# Altium schematic sheet 智联屏.SchDoc
size A2
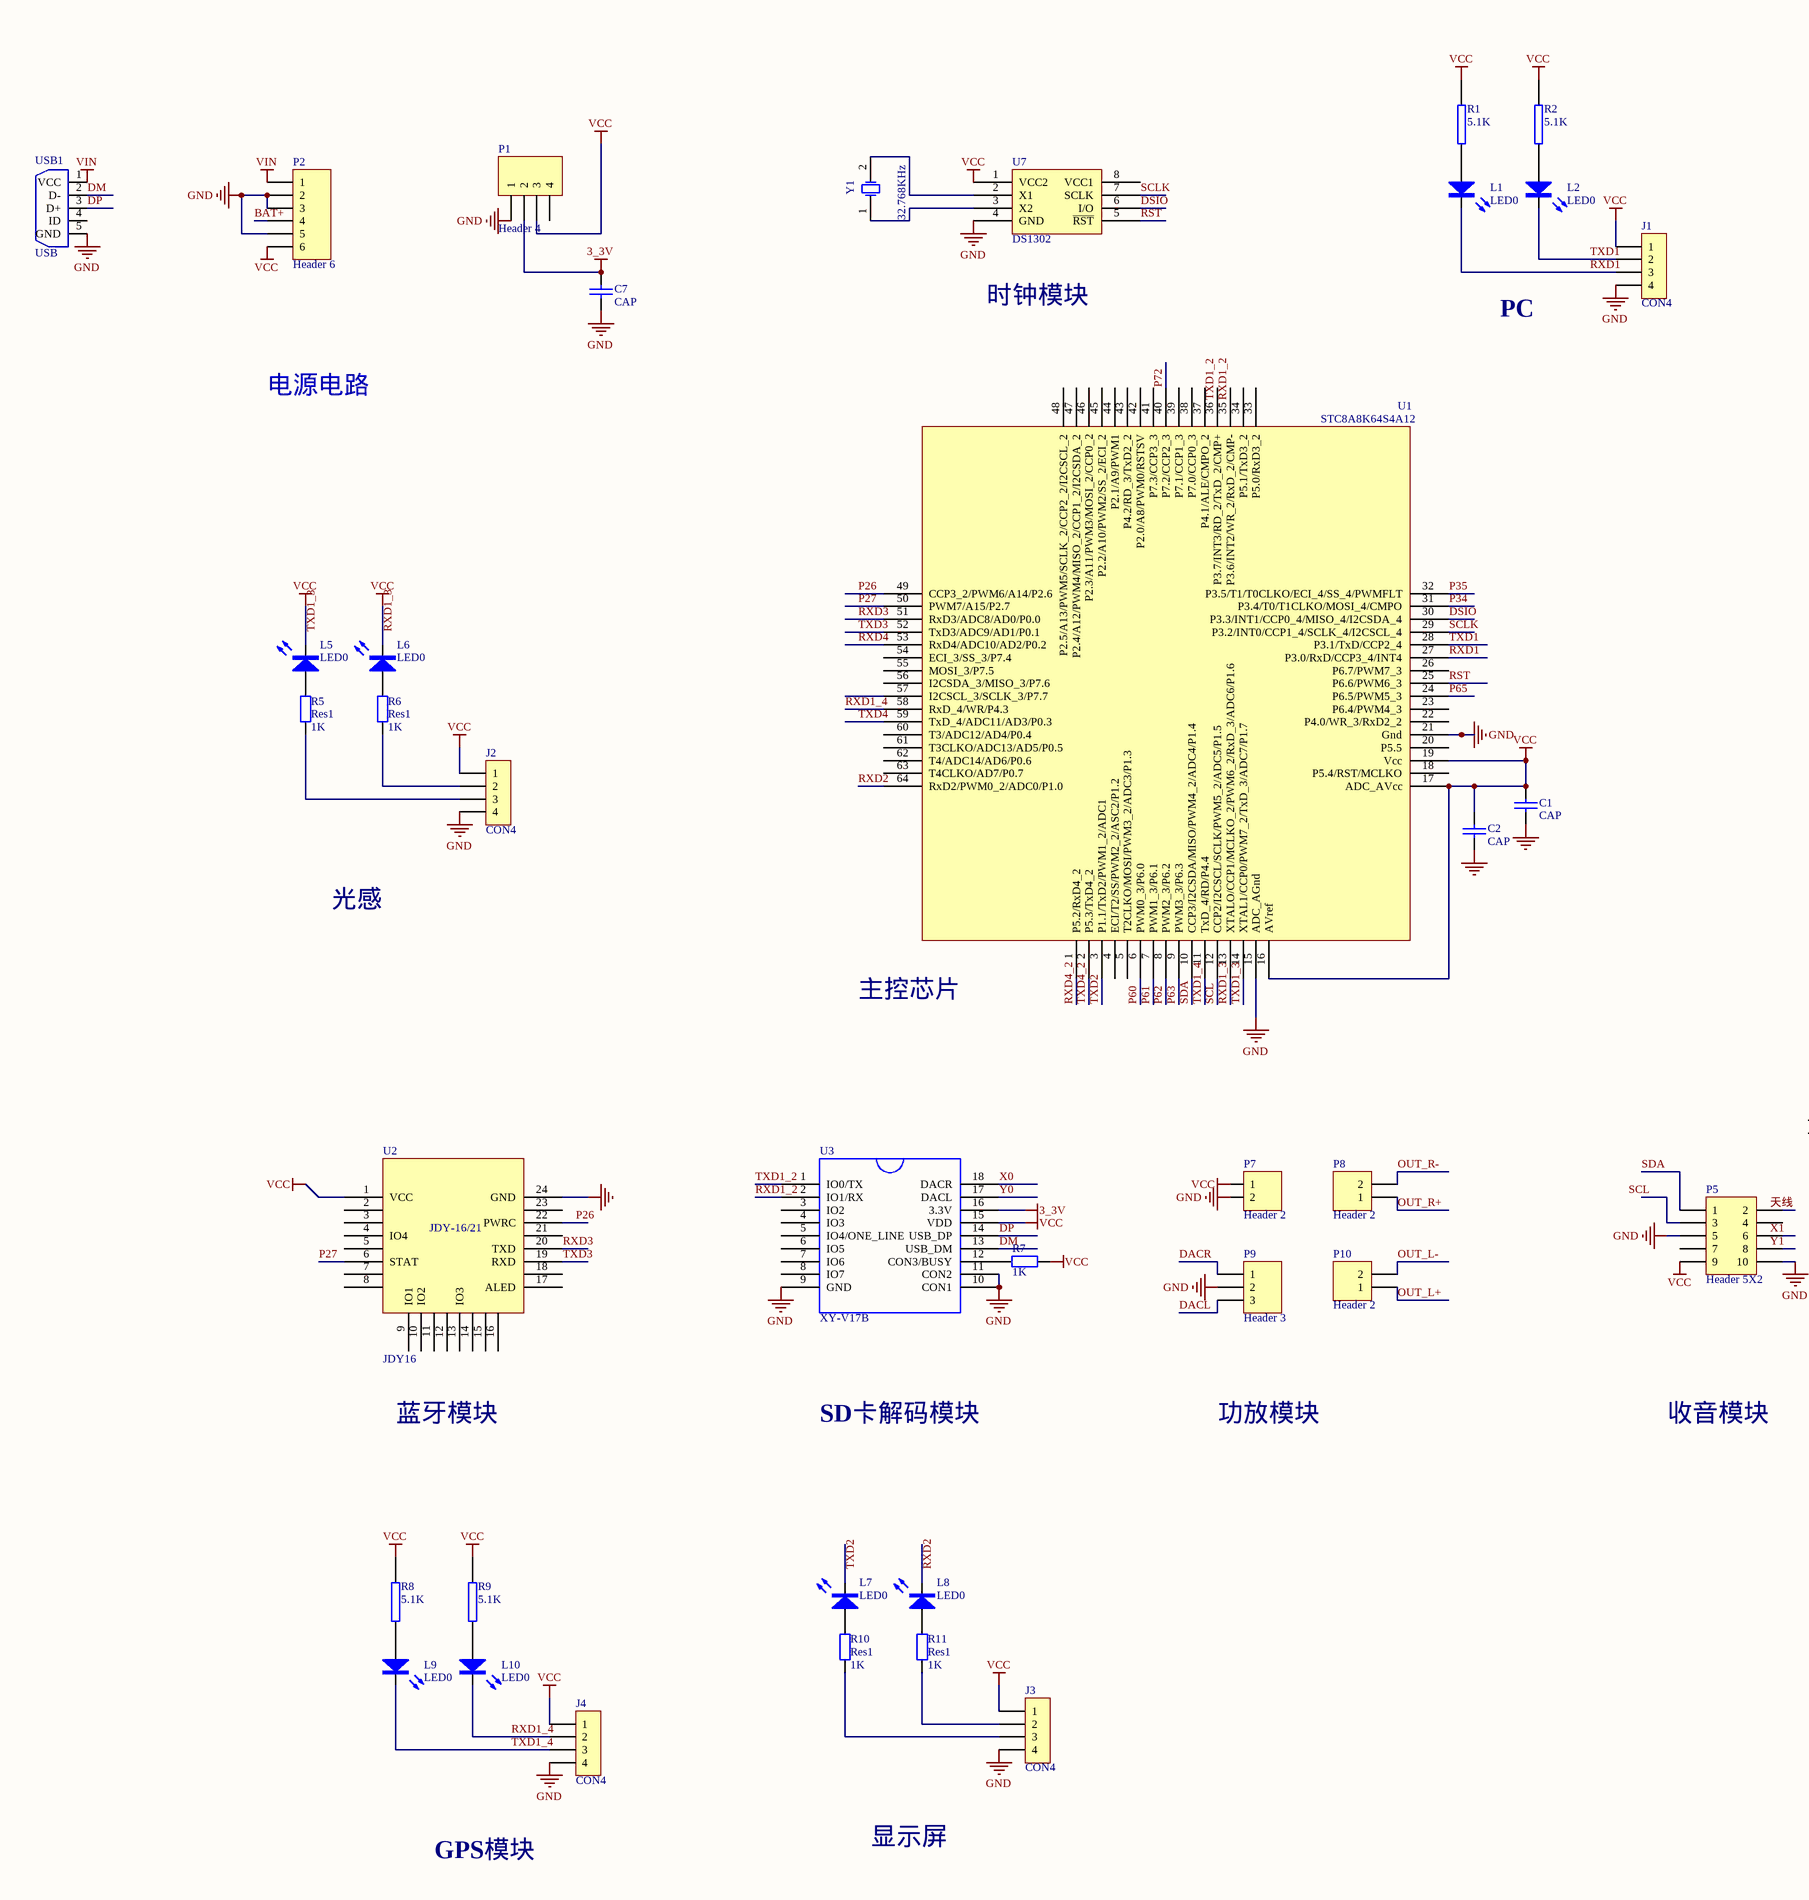
[diagram p0: 智联屏.SchDoc, left]
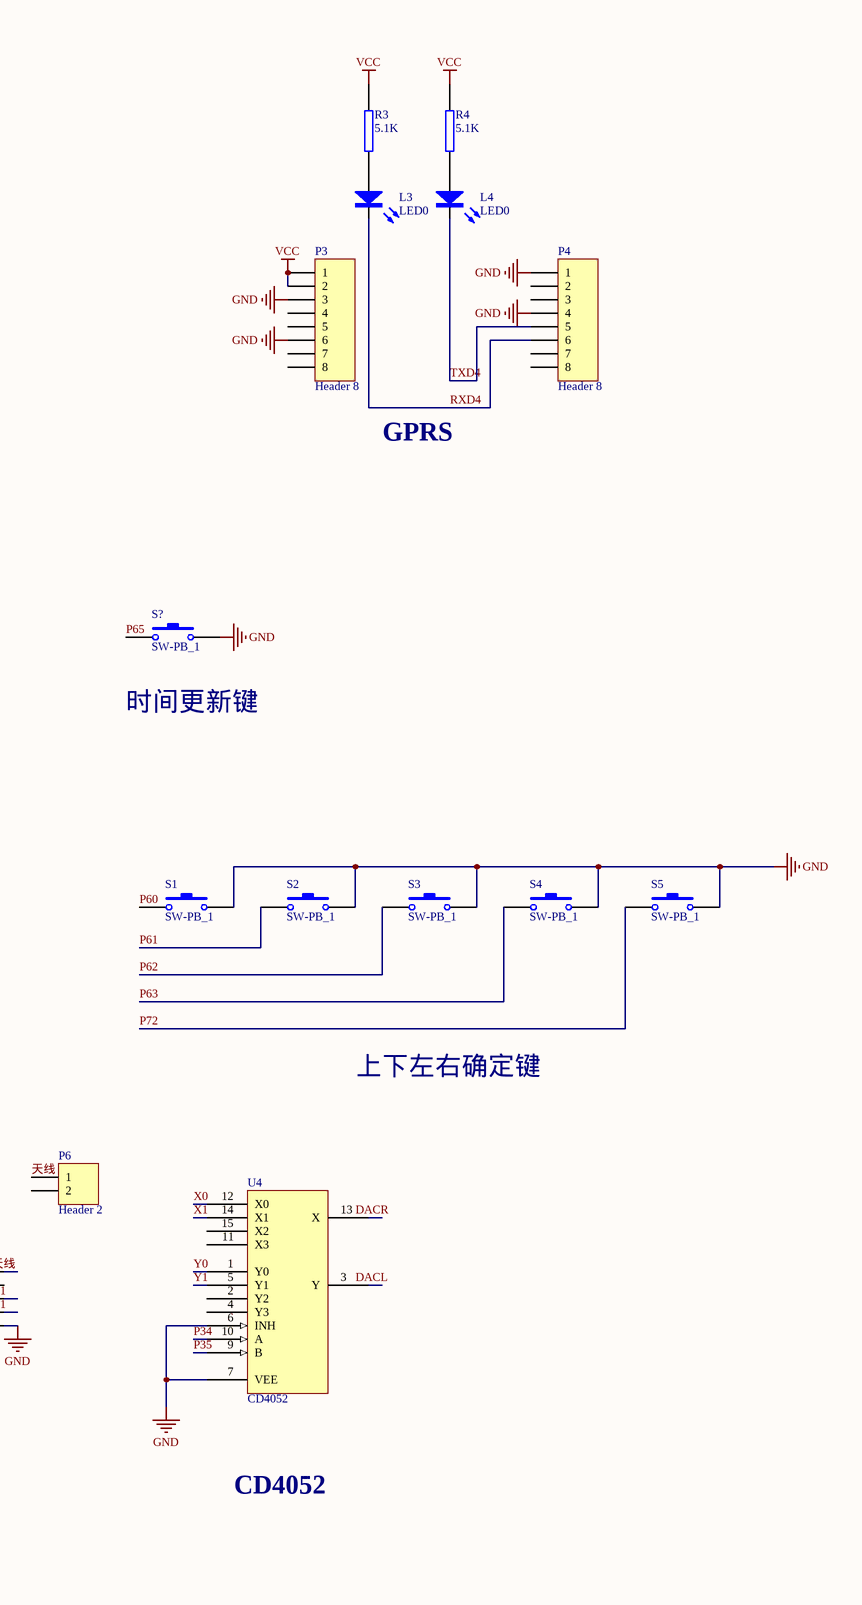
[diagram p1: 智联屏.SchDoc, right]

## Parts
C1  CAP  [0805_L]
C2  CAP  [0805_L]
C7  CAP  [0805_L]
J1  CON4  [SP4-1]
J2  CON4  [SP4-1]
J3  CON4  [SP4-1]
J4  CON4  [SP4-1]
L1  LED0  [TPLED]
L2  LED0  [TPLED]
L3  LED0  [TPLED]
L4  LED0  [TPLED]
L5  LED0  [TPLED]
L6  LED0  [TPLED]
L7  LED0  [TPLED]
L8  LED0  [TPLED]
L9  LED0  [TPLED]
L10  LED0  [TPLED]
P1  Header 4  [1117]
P2  Header 6  [HT396K-6]
P3  Header 8  [HDR1X8]
P4  Header 8  [HDR1X8]
P5  Header 5X2  [HDR2X5]
P6  Header 2  [HDR1X2]
P7  Header 2  [XH254-2]
P8  Header 2  [XH254-2]
P9  Header 3  [HT396K-3]
P10  Header 2  [XH254-2]
R1  5.1K  [0805_L]
R2  5.1K  [0805_L]
R3  5.1K  [0805_L]
R4  5.1K  [0805_L]
R5  Res1  value 1K  [AXIAL-0.4]
R6  Res1  value 1K  [AXIAL-0.4]
R7  value 1K  [AXIAL-0.3]  (hidden comment: Resistor)
R8  5.1K  [0805_L]
R9  5.1K  [0805_L]
R10  Res1  value 1K  [AXIAL-0.4]
R11  Res1  value 1K  [AXIAL-0.4]
S1  SW-PB_1  [BUTTON_6*6]
S2  SW-PB_1  [BUTTON_6*6]
S3  SW-PB_1  [BUTTON_6*6]
S4  SW-PB_1  [BUTTON_6*6]
S5  SW-PB_1  [BUTTON_6*6]
S?  SW-PB_1  [BUTTON_6*6]
U1  STC8A8K64S4A12  [LQFP-64_10x10x05P_Q2]
U2  JDY16  [JDY16]
U3  XY-V17B
U4  CD4052  [DIP-16]
U7  DS1302  [SOP-8_150mil]
USB1  USB  [MICRO_USB5P_SOP]
Y1  32.768KHz  [CRY_柱式卧装]

## Nets
3_3V: C7.1 P1.2 U3.16(3.3V)
GND: C1.2 C2.2 C7.2 J1.4 J2.4 J3.4 J4.4 P1.1 P2.2 P2.3 P2.5 P3.3 P3.6 P4.1 P4.4 P5.5 P5.10 P9.2 S1.2 S2.2 S3.2 S4.2 S5.2 S?.2 U1.15(ADC_AGnd) U1.21(Gnd) U2.24(GND) U3.9(GND) U3.10(CON1) U3.11(CON2) U4.6(INH) U4.7(VEE) U4.8(GND) U7.4(GND) USB1.5(GND)
VCC: C1.1 C2.1 J1.1 J2.1 J3.1 J4.1 L5.2(K) L6.2(K) P1.3 P2.6 P3.1 P3.2 P5.9 R1.2 R2.2 R3.2 R4.2 R7.1 R8.2 R9.2 U1.16(AVref) U1.17(ADC_AVcc) U1.19(Vcc) U2.1(VCC) U3.15(VDD) U4.16(VCC) U7.1(VCC2)
VIN: P2.1 USB1.1(VCC)
BAT+: P2.4
DACL: P9.3
DACR: P9.1
DM: U3.13(USB_DM) USB1.2(D-)
DP: U3.14(USB_DP) USB1.3(D+)
DSIO: U1.30(P3.3/INT1/CCP0_4/MISO_4/I2CSDA_4) U7.6(I/O)
OUT_L+: P10.1
OUT_L-: P10.2
OUT_R+: P8.1
OUT_R-: P8.2
P26: U1.49(CCP3_2/PWM6/A14/P2.6) U2.22(PWRC)
P27: U1.50(PWM7/A15/P2.7) U2.6(STAT)
P34: U1.31(P3.4/T0/T1CLKO/MOSI_4/CMPO) U4.10(A)
P35: U1.32(P3.5/T1/T0CLKO/ECI_4/SS_4/PWMFLT) U4.9(B)
P60: S1.1 U1.6(PWM0_3/P6.0)
P61: S2.1 U1.7(PWM1_3/P6.1)
P62: S3.1 U1.8(PWM2_3/P6.2)
P63: S4.1 U1.9(PWM3_3/P6.3)
P65: S?.1 U1.24(P6.5/PWM5_3)
P72: S5.1 U1.40(P7.2/CCP2_3)
RST: U1.25(P6.6/PWM6_3) U7.5(~{RST})
RXD1: J1.3 L1.2(K) U1.27(P3.0/RxD/CCP3_4/INT4)
RXD1_2: U3.2(IO1/RX)
RXD1_3: U1.13(XTALO/CCP1/MCLKO_2/PWM6_2/RxD_3/ADC6/P1.6)
RXD1_4: J4.2 L10.2(K) U1.58(RxD_4/WR/P4.3)
RXD2: U1.64(RxD2/PWM0_2/ADC0/P1.0)
RXD3: U1.51(RxD3/ADC8/AD0/P0.0) U2.20(TXD)
RXD4: L3.2(K) P4.6 U1.53(RxD4/ADC10/AD2/P0.2)
RXD4_2: U1.1(P5.2/RxD4_2)
SCL: U1.12(CCP2/I2CSCL/SCLK/PWM5_2/ADC5/P1.5)
SCLK: U1.29(P3.2/INT0/CCP1_4/SCLK_4/I2CSCL_4) U7.7(SCLK)
SDA: P5.1 U1.10(CCP3/I2CSDA/MISO/PWM4_2/ADC4/P1.4)
TXD1: J1.2 L2.2(K) U1.28(P3.1/TxD/CCP2_4)
TXD1_2: U3.1(IO0/TX)
TXD1_3: U1.14(XTAL1/CCP0/PWM7_2/TxD_3/ADC7/P1.7)
TXD1_4: J4.3 L9.2(K) U1.11(TxD_4/RD/P4.4)
TXD2: U1.3(P1.1/TxD2/PWM1_2/ADC1)
TXD3: U1.52(TxD3/ADC9/AD1/P0.1) U2.19(RXD)
TXD4: L4.2(K) P4.5 U1.59(TxD_4/ADC11/AD3/P0.3)
TXD4_2: U1.2(P5.3/TxD4_2)
X0: U3.18(DACR) U4.12(X0)
X1: U4.14(X1)
Y0: U3.17(DACL) U4.1(Y0)
Y1: U4.5(Y1)
天线: P6.1
NetJ2_2: J2.2 R6.2
NetJ2_3: J2.3 R5.2
NetJ3_2: J3.2 R11.2
NetJ3_3: J3.3 R10.2
NetL1_1: L1.1(A) R1.1
NetL2_1: L2.1(A) R2.1
NetL3_1: L3.1(A) R3.1
NetL4_1: L4.1(A) R4.1
NetL5_1: L5.1(A) R5.1
NetL6_1: L6.1(A) R6.1
NetL7_1: L7.1(A) R10.1
NetL8_1: L8.1(A) R11.1
NetL9_1: L9.1(A) R8.1
NetL10_1: L10.1(A) R9.1
NetR7_2: R7.2 U3.12(CON3/BUSY)
NetU7_2: U7.2(X1) Y1.2(OSC2)
NetU7_3: U7.3(X2) Y1.1(OSC1)

Not connected (* = marked no-connect by the designer): L7 2(K); L8 2(K); P1 4; P3 4 5 7 8; P4 2 3 7 8; P5 2 3 4 6 7 8; P6 2; P7 1 2; U1 4(ECI/T2/SS/PWM2_2/ASC2/P1.2) 5(T2CLKO/MOSI/PWM3_2/ADC3/P1.3) 18(P5.4/RST/MCLKO) 20(P5.5) 22(P4.0/WR_3/RxD2_2) 23(P6.4/PWM4_3) 26(P6.7/PWM7_3) 33(P5.0/RxD3_2) 34(P5.1/TxD3_2) 35(P3.6/INT2/WR_2/RxD_2/CMP-) 36(P3.7/INT3/RD_2/TxD_2/CMP+) 37(P4.1/ALE/CMPO_2) 38(P7.0/CCP0_3) 39(P7.1/CCP1_3) 41(P7.3/CCP3_3) 42(P2.0/A8/PWM0/RSTSV) 43(P4.2/RD_3/TxD2_2) 44(P2.1/A9/PWM1) 45(P2.2/A10/PWM2/SS_2/ECI_2) 46(P2.3/A11/PWM3/MOSI_2/CCP0_2) 47(P2.4/A12/PWM4/MISO_2/CCP1_2/I2CSDA_2) 48(P2.5/A13/PWM5/SCLK_2/CCP2_2/I2CSCL_2) 54(ECI_3/SS_3/P7.4) 55(MOSI_3/P7.5) 56(I2CSDA_3/MISO_3/P7.6) 57(I2CSCL_3/SCLK_3/P7.7) 60(T3/ADC12/AD4/P0.4) 61(T3CLKO/ADC13/AD5/P0.5) 62(T4/ADC14/AD6/P0.6) 63(T4CLKO/AD7/P0.7); U2 2 3 4(IO4) 5 7 8 9(IO1) 10(IO2) 11 12 13(IO3) 14 15 16 17(ALED) 18 21 23; U3 3(IO2) 4(IO3) 5(IO4/ONE_LINE) 6(IO5) 7(IO6) 8(IO7); U4 2(Y2) 3(Y) 4(Y3) 11(X3) 13(X) 15(X2); U7 8(VCC1); USB1 4(ID)

## Notes on the sheet
- 时钟模块
- PC
- 电源电路
- GPRS
- (near S?) 时间更新键
- 光感
- (near U1) 主控芯片
- 上下左右确定键
- 蓝牙模块
- SD卡解码模块
- 功放模块
- 收音模块
- CD4052
- GPS模块
- 显示屏
- Labels drawn without touching a wire or pin: DACL, DACR, GND, RXD1_2, RXD1_3, RXD2, SCL, TXD1_2, TXD1_3, TXD2, VCC, X1, Y1, 天线
- (in symbol JDY21) JDY-16/21

## Library data of the parts
C1 C2 C7 = CAP: Capacitor
J1-J4 = CON4: Connector
L1-L10 = LED0: light Emitting Diode
P1 = Header 4: Header, 4-Pin; LatestRevisionDate: 17-Jul-2002; LatestRevisionNote: Re-released for DXP Platform.; Publisher: Altium Limited
P2 = Header 6: Header, 6-Pin; LatestRevisionDate: 17-Jul-2002; LatestRevisionNote: Re-released for DXP Platform.; Publisher: Altium Limited
P3 P4 = Header 8: Header, 8-Pin; LatestRevisionDate: 17-Jul-2002; LatestRevisionNote: Re-released for DXP Platform.; Publisher: Altium Limited
P5 = Header 5X2: Header, 5-Pin, Dual row; LatestRevisionDate: 17-Jul-2002; LatestRevisionNote: Re-released for DXP Platform.; Publisher: Altium Limited
P6-P8 P10 = Header 2: Header, 2-Pin; LatestRevisionDate: 17-Jul-2002; LatestRevisionNote: Re-released for DXP Platform.; Publisher: Altium Limited
P9 = Header 3: Header, 3-Pin; LatestRevisionDate: 17-Jul-2002; LatestRevisionNote: Re-released for DXP Platform.; Publisher: Altium Limited
R1-R4 R8 R9 = RES2
R5 R6 R10 R11 = Res2: Resistor; Published: 8-Jun-2000; LatestRevisionDate: 17-Jul-2002; LatestRevisionNote: Re-released for DXP Platform.; PackageReference: AXIAL-0.4; Publisher: Altium Limited; PackageDescription: Axial Device, Thru-Hole; 2 Leads; 0.4 in Pin Spacing
S1-S5 S? = SW-PB_1: Switch; Published: 24-Mar-1999; LatestRevisionDate: 17-Jul-2002; LatestRevisionNote: Re-released for DXP Platform.; PackageReference: SPST-2; Publisher: Altium Limited
U1 = STC8A8K64S4A12: LQFP64
U2 = JDY21
U3 = MODULE
U7 = DS1302: DS1302 实时时钟
USB1 = USB5
Y1 = 32.768KHz柱状晶振
R7 = Resistor: Published: 8-Jun-2000; Revision: July-2002: Re-released for DXP Platform.; Publisher: Altium Limited